# EasyEDA Pro project demo.eprj

# Schematic Schematic1
Board Name: Board1; Create Date: 2026-05-03; Page Name: P1; Project Name: demo; Schematic Name: Schematic1; Update Date: 2026-06-27; Company: 嘉立创EDA; Page Size: A4; Version: V1.0
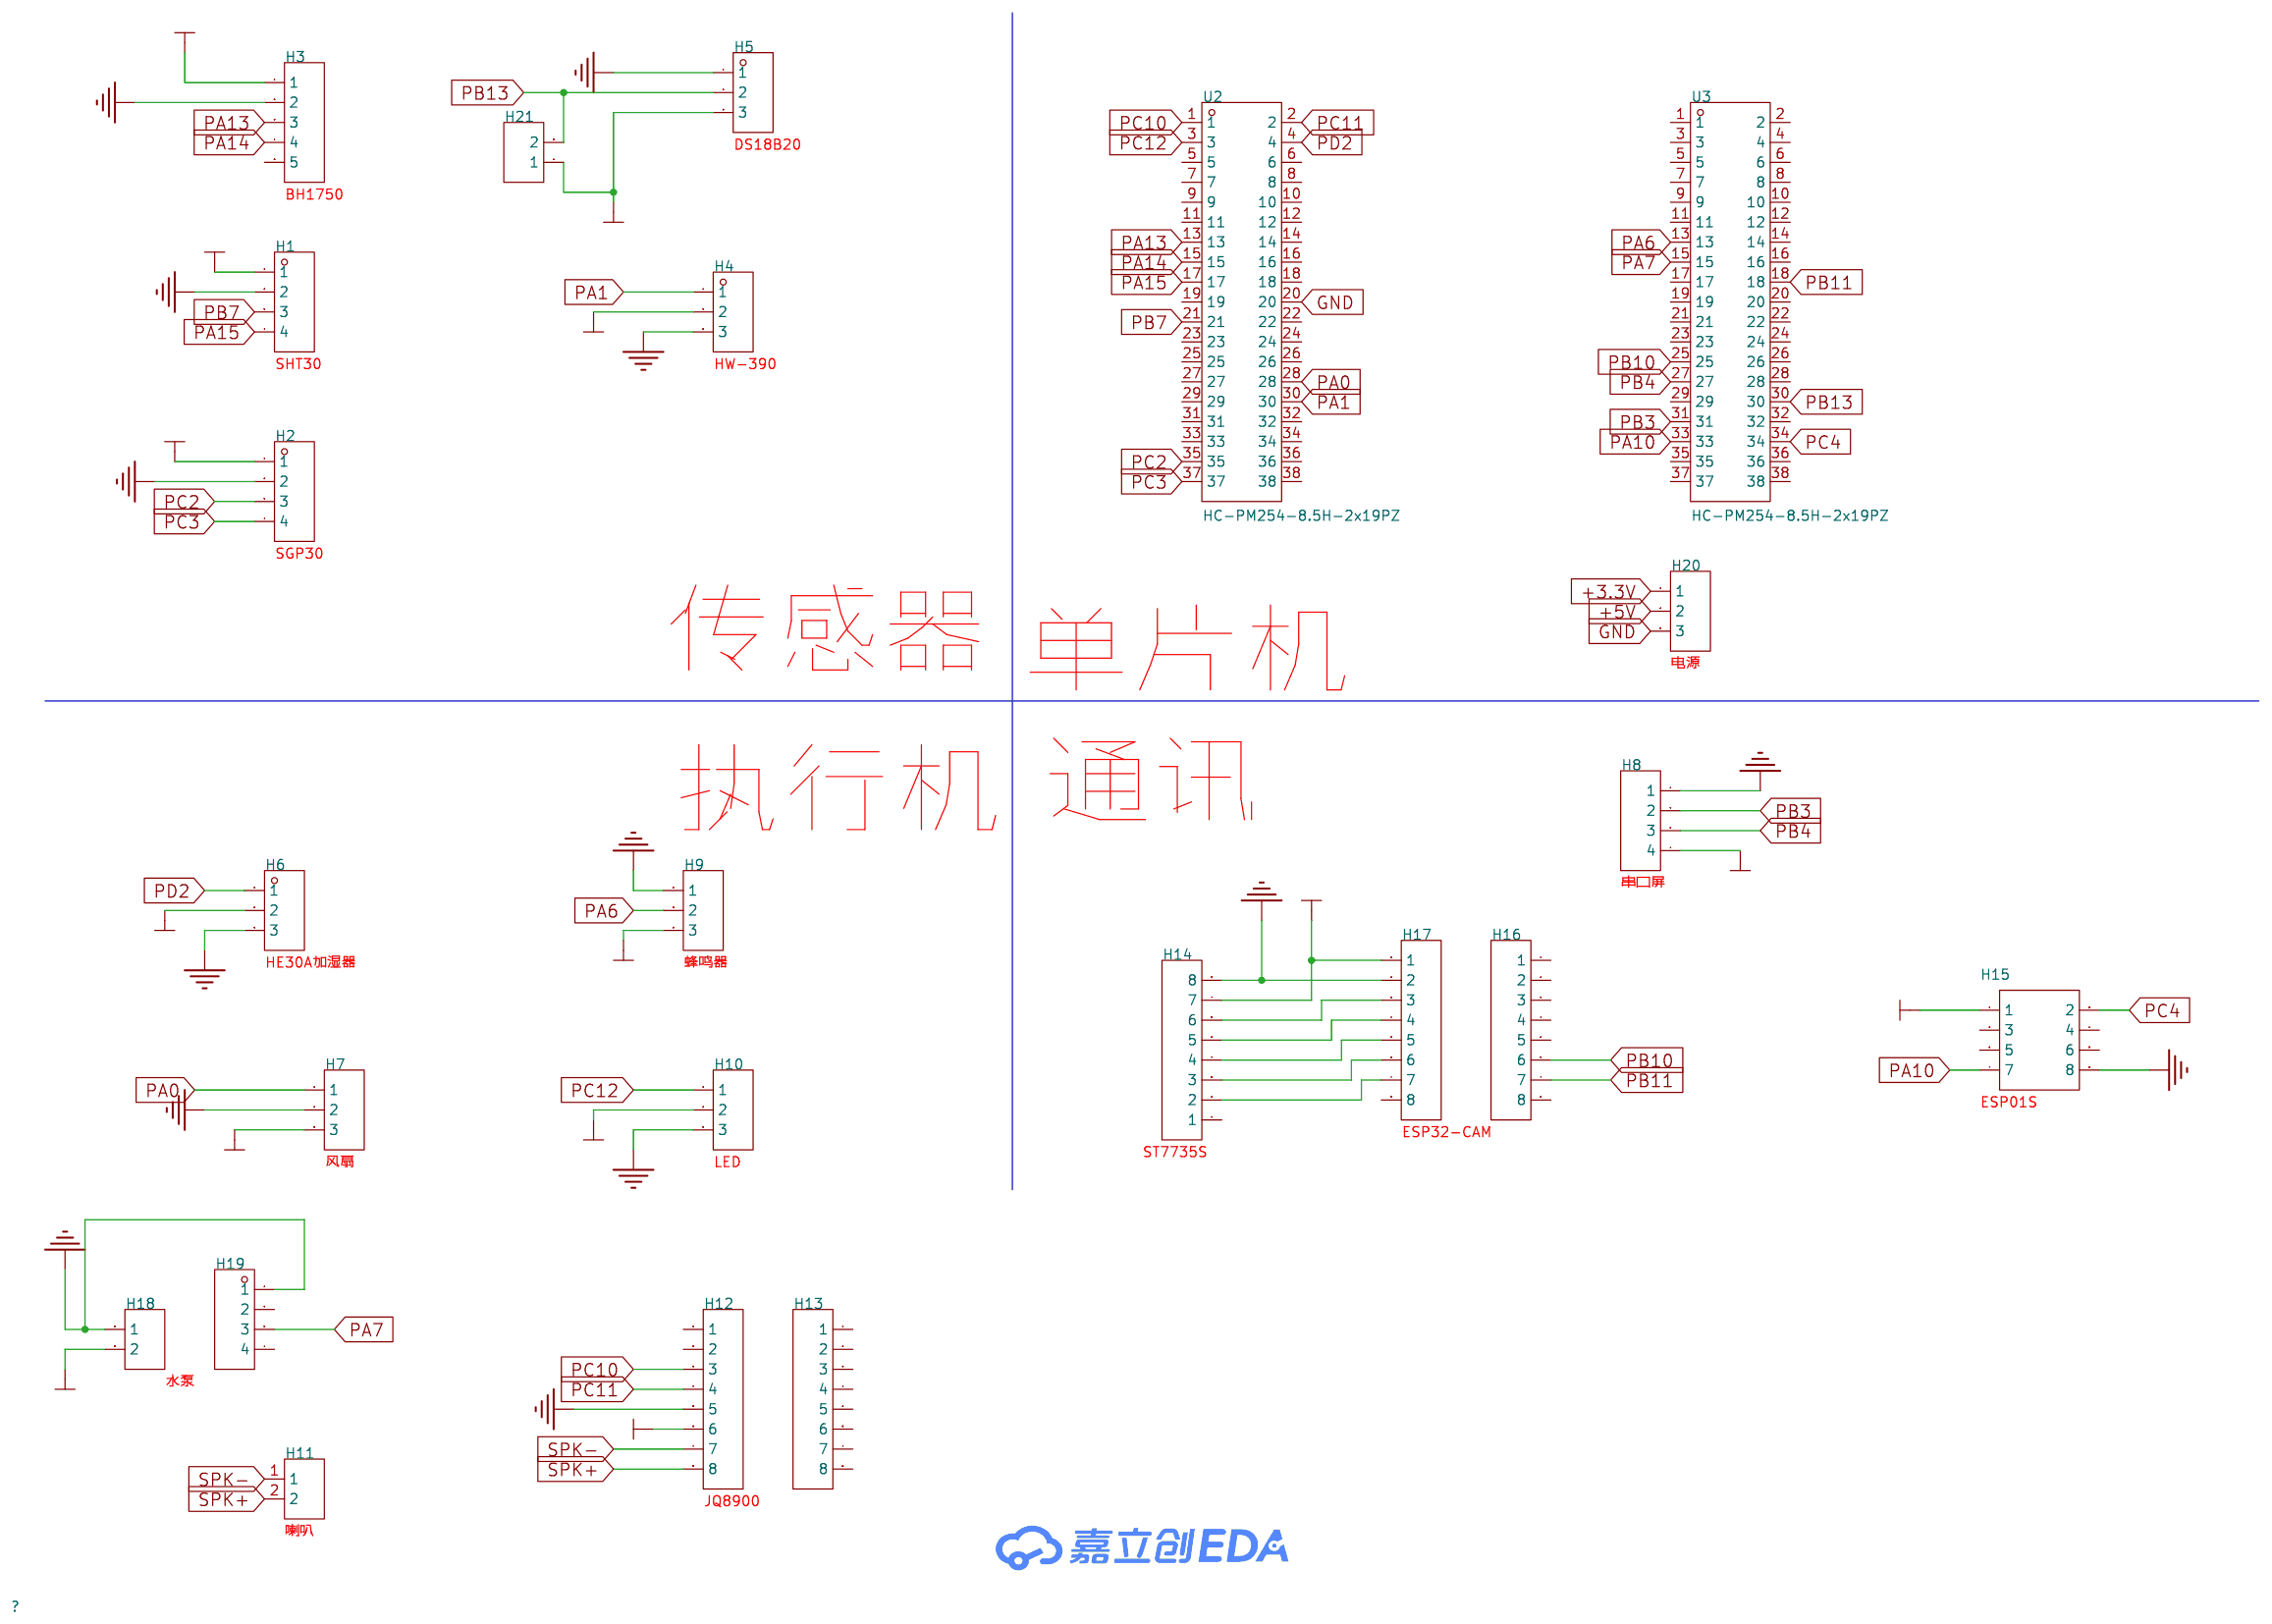
[diagram p0: schematic sheet]

## Parts
H1  -  [HDR-TH_4P-P2.54-V-F]
H2  -  [HDR-TH_4P-P2.54-V-F]
H3  -  [HDR-TH_5P-P2.54-V-F]
H4  -  [HDR-TH_3P-P2.54-V-M]
H5  -  [HDR-TH_3P-P2.54-V-M]
H6  -  [HDR-TH_3P-P2.54-V-M]
H7  -  [HDR-TH_3P-P2.54-V-F]
H8  -  [HDR-TH_4P-P2.54-V-M]
H9  -  [HDR-TH_3P-P2.54-V-F]
H10  -  [HDR-TH_3P-P2.54-V-F]
H11  -  [HDR-TH_2P-P2.54-V-M-1]
H12  -  [HDR-TH_8P-P2.54-V-F-1]
H13  -  [HDR-TH_8P-P2.54-V-F-1]
H14  -  [HDR-TH_8P-P2.54-V-F-1]
H15  -  [HDR-TH_8P-P2.54-V-F-R2-C4-S2.54-1]
H16  -  [HDR-TH_8P-P2.54-V-F-1]
H17  -  [HDR-TH_8P-P2.54-V-F-1]
H18  -  [HDR-TH_2P-P2.54-V-F]
H19  -  [HDR-TH_4P-P2.54-V-F]
H20  -  [HDR-TH_3P-P2.54-V-F]
H21  -  [HDR-TH_2P-P2.54-V-F]
U2  HC-PM254-8.5H-2x19PZ  [HDR-TH_38P-P2.54-V-F-R2-C19-S2.54]
U3  HC-PM254-8.5H-2x19PZ  [HDR-TH_38P-P2.54-V-F-R2-C19-S2.54]

## Library data of the parts
H1 H2 H19 = HDR-F_2.54_1x4P: Supplier Part: C2718488; Supplier Footprint: 插件
H3 = HDR-F_2.54_1x5P: Supplier Part: C50950; Supplier Footprint: 插件
H4-H6 = HDR-M_2.54_1x3P: Supplier Part: C2937625; Supplier Footprint: 插件
H7 H9 H10 H20 = HDR-F_2.54_1x3P: Supplier Part: C541850; Supplier Footprint: 插件
H8 = HDR-M_2.54_1x4P: Supplier Part: C492403; Supplier Footprint: 插件
H11 = HDR-M_2.54_1x2P: Supplier Part: C124375; Supplier Footprint: 插件
H12-H14 H16 H17 = HDR-F_2.54_1x8P: Supplier Part: C27438; Supplier Footprint: 插件
H15 = HDR-F_2.54_2x4: Supplier Part: C92271; Supplier Footprint: 插件
H18 H21 = HDR-F_2.54_1x2P: Supplier Part: C49661; Supplier Footprint: 插件
U2 U3 = HC-PM254-8.5H-2x19PZ: LCSC Part Name: 间距2.54mm 2x19Pin 直插 PC3.0 H8.5; Supplier Part: C22373924; Manufacturer: HC(虹成电子); Supplier Footprint: 插件,P=2.54mm; JLCPCB Part Class: 扩展库; Datasheet: https://item.szlcsc.com/datasheet/HC-PM254-8.5H-2x19PZ/23870260.html; Supplier: LCSC; Holes Structure: 2x19P; Pitch: 2.54mm; Row Spacing: 2.54mm; Circular Hole / Square Hole: 方孔; Mounting Type: 直插; Number of Rows: 双排; Number of Positions: 38P; Current Rating: 3A; Holes Direction: 顶部; Insulation Height: 8.5mm; Contact Material: 黄铜; Contact Plating: 金; Operating Temperature: -40℃~+105℃; PIN Length: 3mm

## Nets
+3.3V: H1.1 H2.1 H3.1 H4.2 H6.2 H7.3 H9.3 H15.1 H20.1
+5V: H5.3 H8.4 H10.2 H12.6 H14.7 H17.1 H18.2 H20.2 H21.1
GND: H1.2 H2.2 H3.2 H4.3 H5.1 H6.3 H7.2 H8.1 H9.1 H10.3 H12.5 H14.8 H15.8 H17.2 H18.1 H19.1 H20.3 U2.20
PA0: H7.1 U2.28
PA1: H4.1 U2.30
PA6: H9.2 U3.13
PA7: H19.3 U3.15
PA10: H15.7 U3.33
PA13: H3.3 U2.13
PA14: H3.4 U2.15
PA15: H1.4 U2.17
PB3: H8.2 U3.31
PB4: H8.3 U3.27
PB7: H1.3 U2.21
PB10: H16.6 U3.25
PB11: H16.7 U3.18
PB13: H5.2 H21.2 U3.30
PC2: H2.3 U2.35
PC3: H2.4 U2.37
PC4: H15.2 U3.34
PC10: H12.3 U2.1
PC11: H12.4 U2.2
PC12: H10.1 U2.3
PD2: H6.1 U2.4
SPK+: H11.2 H12.8
SPK-: H11.1 H12.7
$1N6070: H14.6 H17.3
$1N6076: H14.5 H17.4
$1N6082: H14.4 H17.5
$1N6088: H14.3 H17.6
$1N6116: H14.2 H17.7

Not connected (* = marked no-connect by the designer): H3 5; H12 1 2; H13 1 2 3 4 5 6 7 8; H14 1; H15 3 4 5 6; H16 1 2 3 4 5 8; H17 8; H19 2 4; U2 5 6 7 8 9 10 11 12 14 16 18 19 22 23 24 25 26 27 29 31 32 33 34 36 38; U3 1 2 3 4 5 6 7 8 9 10 11 12 14 16 17 19 20 21 22 23 24 26 28 29 32 35 36 37 38

## Notes on the sheet
- DS18B20
- BH1750
- SHT30
- HW-390
- SGP30
- 传感器
- 电源
- 单片机
- 执行机
- 通讯
- 串口屏
- HE30A加湿器
- 蜂鸣器
- ESP01S
- ESP32-CAM
- 风扇
- LED
- ST7735S
- 水泵
- JQ8900
- 喇叭

# Board PCB1
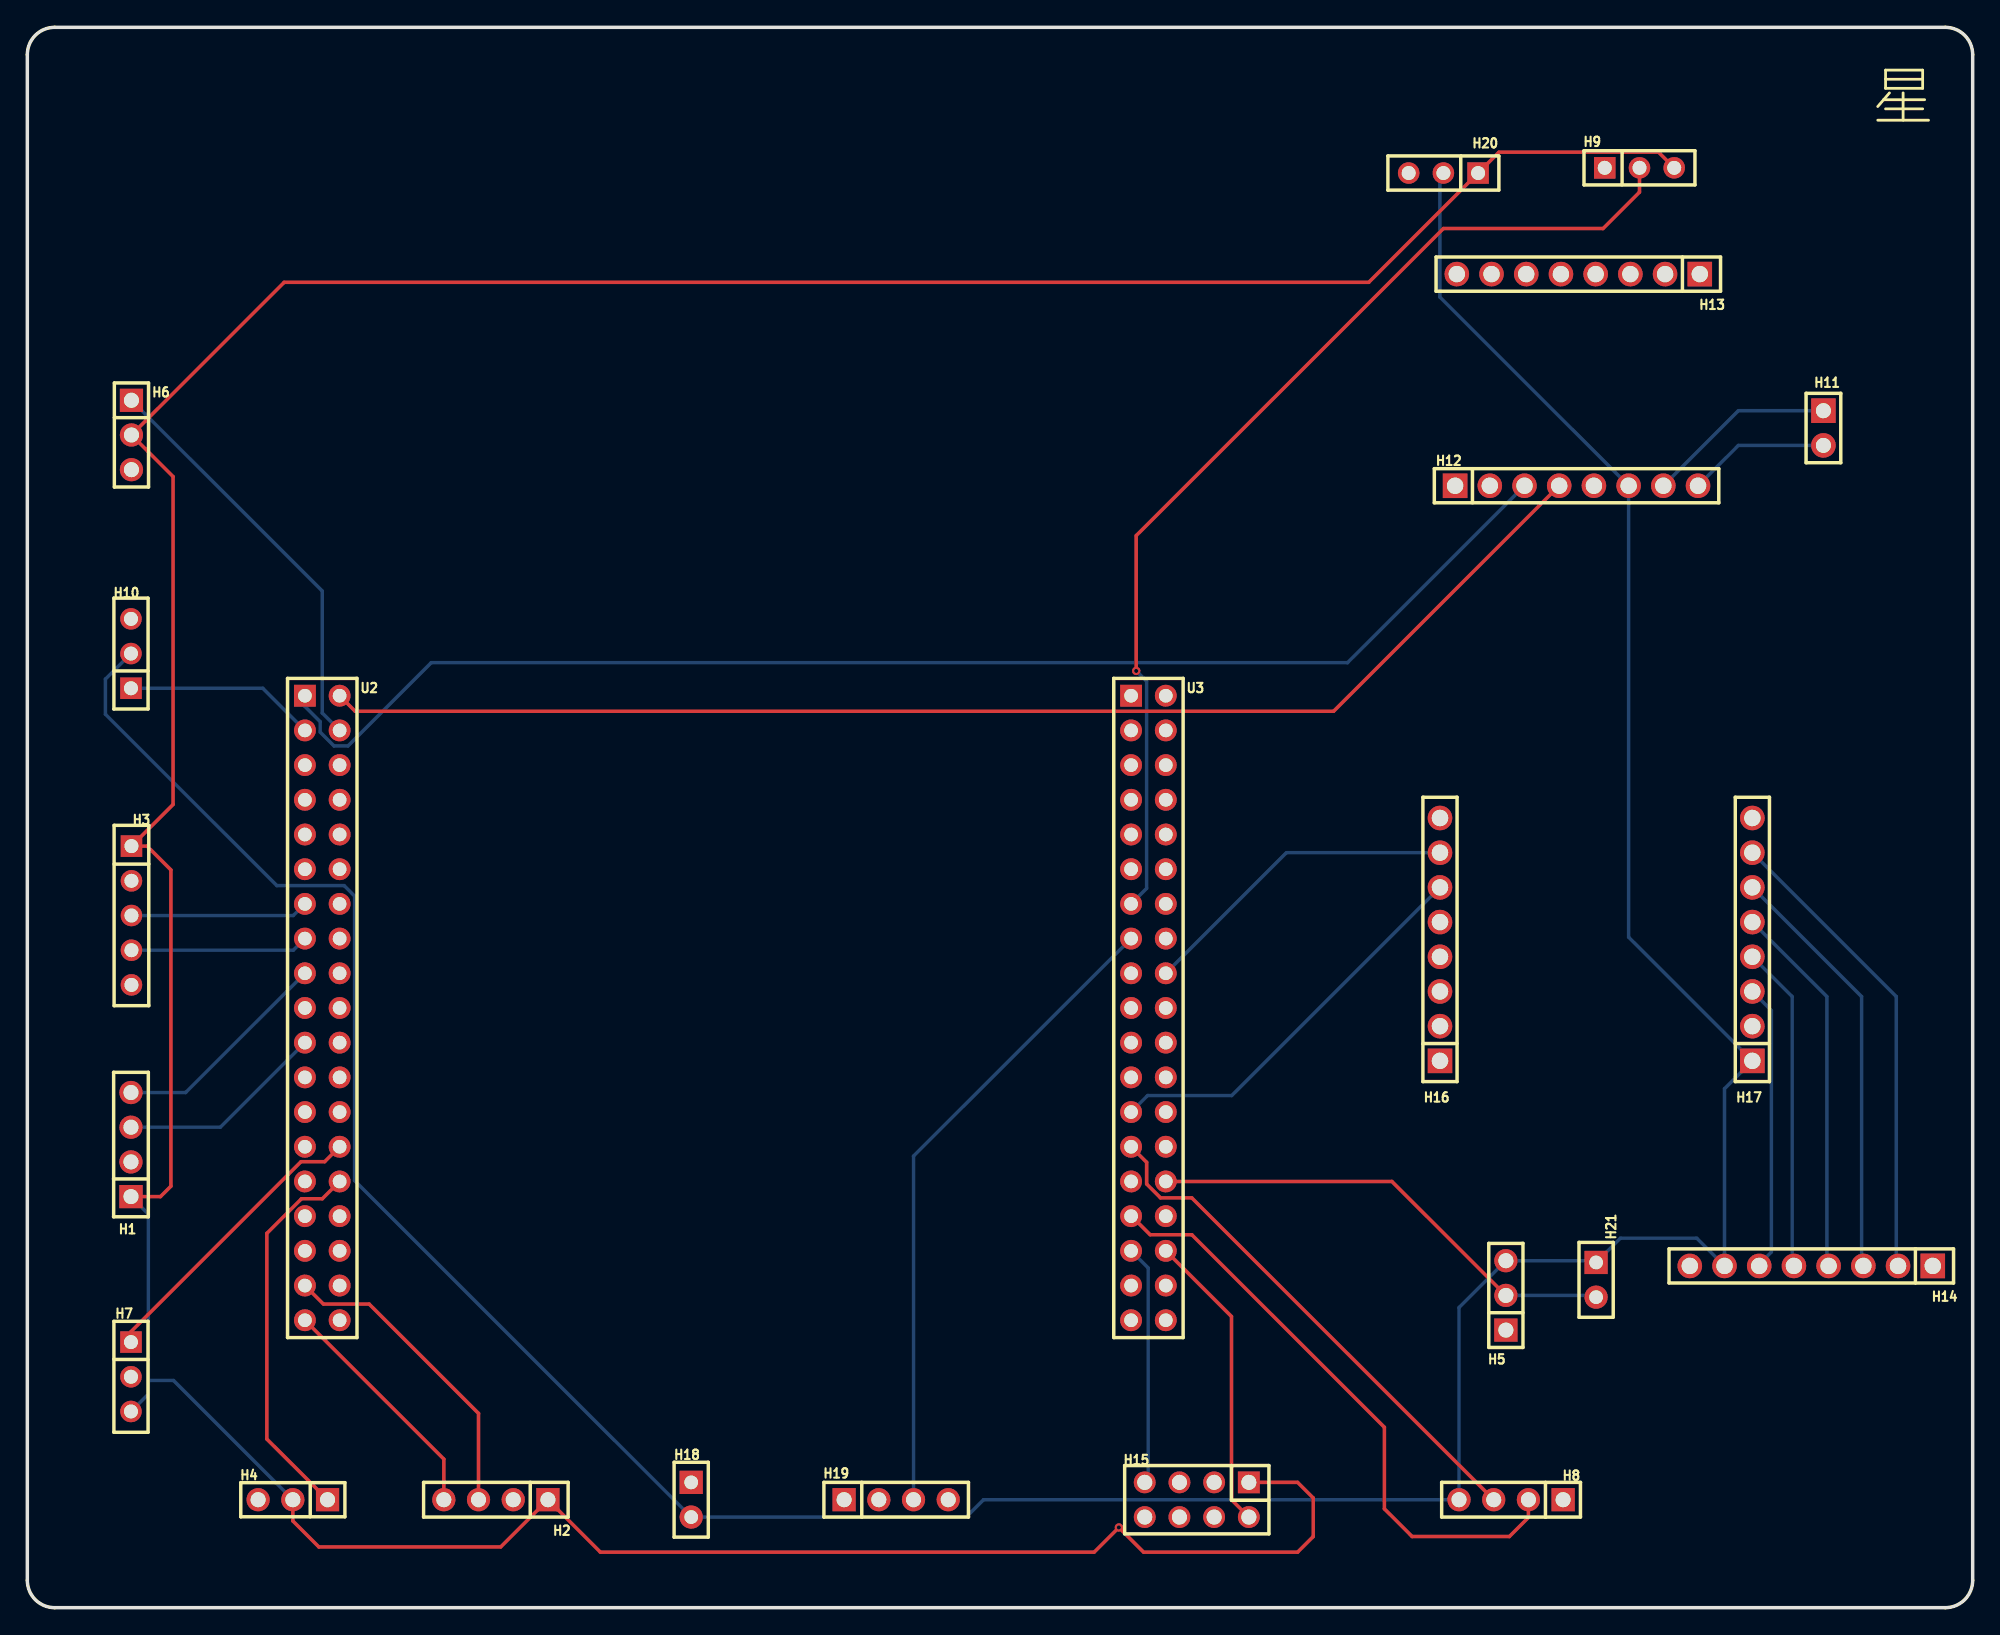
[diagram p1: board, top side]
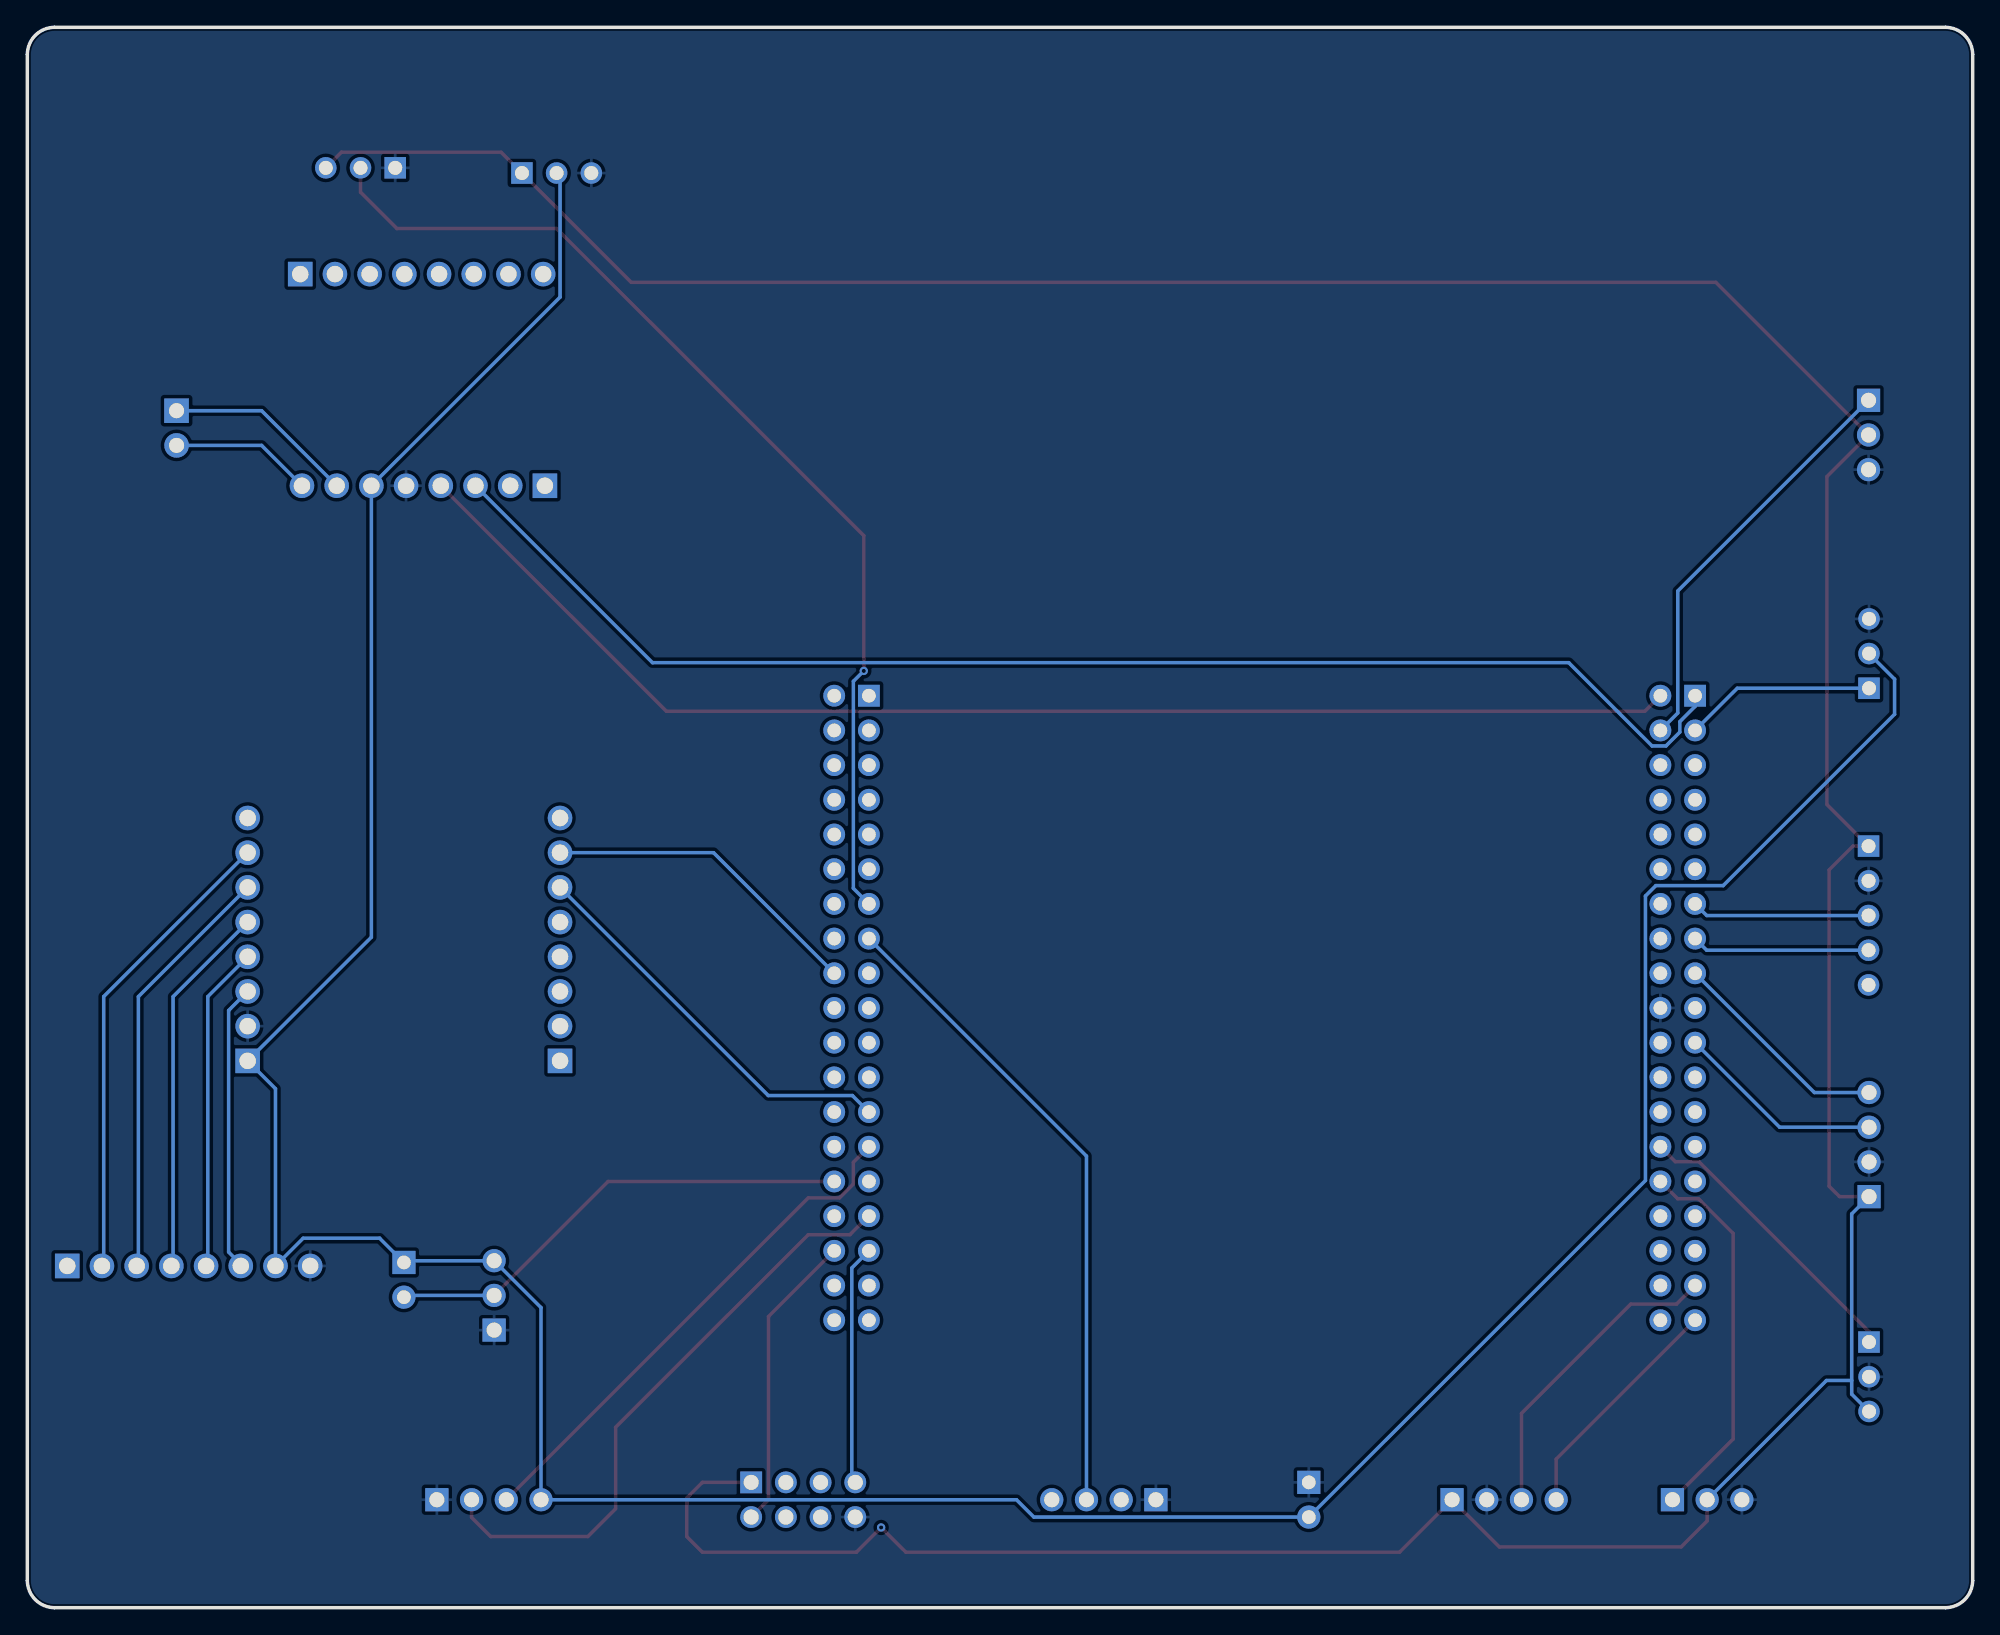
[diagram p2: board, bottom side, seen from below]

Outline 142.37 x 115.7 mm; copper layers: Top Layer, Bottom Layer. Coordinates in mm from the lower left corner of the outline.
Outline path: 0,113.7 0,2 arc(0.59,0.59) 2,0 140.37,0 arc(141.78,0.59) 142.37,2 142.37,113.7 arc(141.78,115.11) 140.37,115.7 2,115.7 arc(0.59,115.11) 0,113.7
Stack: Top Layer 0.035mm / Dielectric1 1.51mm FR4 er 4.5 / Bottom Layer 0.035mm

## Design rules (mm)
template: JLCPCB Capability(Two Layers Board)
spacing copperThickness1oz (default): track to track 0.102, other pairs 0.152 to 0.3
spacing copperThickness2oz: track to track 0.203, other pairs 0.152 to 0.3
track width copperThickness1oz (default): min 0.127, default 0.254, max 2.54
track width copperThickness2oz: min 0.203, default 0.254, max 2.54
differential pair differentialPair (default): width min 0.127, default 0.254, max 2.54; gap min 0.152, default 0.152
via viaSize (default): diameter min 0.5, default 0.61, max 10; hole min 0.3, default 0.305, max 6.3

## Placement (name value [footprint] x y rotation side)
H1  -  [HDR-TH_4P-P2.54-V-F]  7.58 33.9 90 top
H2  -  [HDR-TH_4P-P2.54-V-F]  34.29 7.9 180 top
H3  -  [HDR-TH_5P-P2.54-V-F]  7.62 50.67 270 top
H4  -  [HDR-TH_3P-P2.54-V-M]  19.43 7.9 180 top
H5  -  [HDR-TH_3P-P2.54-V-M]  108.21 22.86 90 top
H6  -  [HDR-TH_3P-P2.54-V-M]  7.62 85.85 270 top
H7  -  [HDR-TH_3P-P2.54-V-F]  7.58 16.9 270 top
H8  -  [HDR-TH_4P-P2.54-V-M]  108.58 7.9 180 top
H9  -  [HDR-TH_3P-P2.54-V-F]  117.98 105.41 0 top
H10  -  [HDR-TH_3P-P2.54-V-F]  7.58 69.85 90 top
H11  -  [HDR-TH_2P-P2.54-V-M-1]  131.44 86.36 270 top
H12  -  [HDR-TH_8P-P2.54-V-F-1]  113.38 82.14 0 top
H13  -  [HDR-TH_8P-P2.54-V-F-1]  113.51 97.63 180 top
H14  -  [HDR-TH_8P-P2.54-V-F-1]  130.56 25.02 180 top
H15  -  [HDR-TH_8P-P2.54-V-F-R2-C4-S2.54-1]  85.58 7.9 180 top
H16  -  [HDR-TH_8P-P2.54-V-F-1]  103.38 48.92 90 top
H17  -  [HDR-TH_8P-P2.54-V-F-1]  126.24 48.92 90 top
H18  -  [HDR-TH_2P-P2.54-V-F]  48.58 7.9 270 top
H19  -  [HDR-TH_4P-P2.54-V-F]  63.58 7.9 0 top
H20  -  [HDR-TH_3P-P2.54-V-F]  103.63 105.03 180 top
H21  -  [HDR-TH_2P-P2.54-V-F]  114.81 24 270 top
U2  HC-PM254-8.5H-2x19PZ  [HDR-TH_38P-P2.54-V-F-R2-C19-S2.54]  21.58 43.9 270 top
U3  HC-PM254-8.5H-2x19PZ  [HDR-TH_38P-P2.54-V-F-R2-C19-S2.54]  82.05 43.9 270 top

## Footprints (pads in the part's own frame, mm; a bottom-side part is the same pattern mirrored in y, then rotated)
HDR-TH_2P-P2.54-V-F
  rect 1.7x1.7 hole 1: 1(-1.27,0)
  round 1.7 hole 1: 2(1.27,0)
HDR-TH_2P-P2.54-V-M-1
  rect 1.8x1.8 hole 1.1: 1(-1.27,0)
  round 1.8 hole 1.1: 2(1.27,0)
HDR-TH_3P-P2.54-V-F
  rect 1.575x1.575 hole 1.02: 1(-2.54,0)
  round 1.575 hole 1.02: 2(0,0) 3(2.54,0)
HDR-TH_3P-P2.54-V-M
  rect 1.7x1.7 hole 1.1: 1(-2.54,0)
  round 1.7 hole 1.1: 2(0,0) 3(2.54,0)
HDR-TH_4P-P2.54-V-F
  rect 1.7x1.7 hole 1.1: 1(-3.81,0)
  round 1.7 hole 1.1: 2(-1.27,0) 3(1.27,0) 4(3.81,0)
HDR-TH_4P-P2.54-V-M
  rect 1.7x1.7 hole 1.1: 1(-3.81,0)
  round 1.7 hole 1.1: 2(-1.27,0) 3(1.27,0) 4(3.81,0)
HDR-TH_5P-P2.54-V-F
  rect 1.575x1.575 hole 1.02: 1(-5.08,0)
  round 1.575 hole 1.02: 2(-2.54,0) 3(0,0) 4(2.54,0) 5(5.08,0)
HDR-TH_8P-P2.54-V-F-1
  rect 1.8x1.8 hole 1.2: 1(-8.89,0)
  round 1.8 hole 1.2: 2(-6.35,0) 3(-3.81,0) 4(-1.27,0) 5(1.27,0) 6(3.81,0) 7(6.35,0) 8(8.89,0)
HDR-TH_8P-P2.54-V-F-R2-C4-S2.54-1
  rect 1.6x1.6 hole 1.1: 1(-3.81,-1.27)
  round 1.6 hole 1.1: 2(-3.81,1.27) 3(-1.27,-1.27) 4(-1.27,1.27) 5(1.27,-1.27) 6(1.27,1.27) 7(3.81,-1.27) 8(3.81,1.27)
HDR-TH_38P-P2.54-V-F-R2-C19-S2.54
  rect 1.6x1.6 hole 1: 1(-22.86,-1.27)
  round 1.6 hole 1: 2(-22.86,1.27) 3(-20.32,-1.27) 4(-20.32,1.27) 5(-17.78,-1.27) 6(-17.78,1.27) 7(-15.24,-1.27) 8(-15.24,1.27) 9(-12.7,-1.27) 10(-12.7,1.27) 11(-10.16,-1.27) 12(-10.16,1.27) 13(-7.62,-1.27) 14(-7.62,1.27) 15(-5.08,-1.27) 16(-5.08,1.27) 17(-2.54,-1.27) 18(-2.54,1.27) 19(0,-1.27) 20(0,1.27) 21(2.54,-1.27) 22(2.54,1.27) 23(5.08,-1.27) 24(5.08,1.27) 25(7.62,-1.27) 26(7.62,1.27) 27(10.16,-1.27) 28(10.16,1.27) 29(12.7,-1.27) 30(12.7,1.27) 31(15.24,-1.27) 32(15.24,1.27) 33(17.78,-1.27) 34(17.78,1.27) 35(20.32,-1.27) 36(20.32,1.27) 37(22.86,-1.27) 38(22.86,1.27)

## Nets
As in the schematic.

Pads without a net: H3 5; H12 1 2; H13 1 2 3 4 5 6 7 8; H14 1; H15 3 4 5 6; H16 1 2 3 4 5 8; H17 8; H19 2 4; U2 5 6 7 8 9 10 11 12 14 16 18 19 22 23 24 25 26 27 29 31 32 33 34 36 38; U3 1 2 3 4 5 6 7 8 9 10 11 12 14 16 17 19 20 21 22 23 24 26 28 29 32 35 36 37 38

## Via types
v1: diameter 0.61, hole 0.305, Top Layer to Bottom Layer, 2 vias

## Routing (per net, layer and track width the routed paths; a pad name or vN(x,y) marks a point on that pad's centre or on a via; arc(x,y) is an arc through that point)
+3.3V: length 305.6
  Top Layer w0.254: H1.1 9.74,30.09 10.51,30.86 10.51,54.01 8.76,55.75 H3.1 10.67,58.8 10.67,82.8 H6.2 18.8,97.03 98.17,97.03 H20.1 107.7,106.55 119.38,106.55 H9.3 ; H15.1 92.96,9.17 94.11,8.03 94.11,5.21 92.96,4.06 81.69,4.06 v1(79.88,5.87) 78.08,4.06 41.94,4.06 H2.1 34.64,4.44 21.34,4.44 19.43,6.35 H4.2
  Bottom Layer w0.254: 8.85,16.63 10.7,16.63 H4.2 ; 8.85,16.63 8.85,15.63 H7.3 ; 8.85,16.63 8.85,28.82 H1.1
+5V: length 268.3
  Bottom Layer w0.254: H10.2 5.71,67.98 5.71,65.41 18.26,52.86 23.18,52.86 23.95,52.1 23.95,31.27 H18.2 68.71,6.63 69.98,7.9 H8.4 104.77,21.97 H5.3 114.68,25.4 H21.1 116.59,27.05 122.17,27.05 H14.7 124.21,37.99 H17.1 117.19,49.09 H12.6 103.38,95.95 103.38,104.78 H20.2
PA0: length 21.6
  Top Layer w0.254: H7.1 7.58,20.21 20.03,32.65 21.76,32.65 U2.28
PA1: length 28.2
  Top Layer w0.254: U2.30 21.59,29.94 20.07,29.94 17.53,27.4 17.53,12.35 H4.1
PA6: length 76.8
  Top Layer w0.254: H9.2 117.98,103.63 115.32,100.97 103.63,100.97 81.15,78.49 v1(81.15,68.58)
  Bottom Layer w0.254: v1(81.15,68.58) 81.92,67.82 81.92,52.66 U3.13
PA7: length 47.7
  Bottom Layer w0.254: U3.15 64.86,33.06 H19.3
PA10: length 17.6
  Bottom Layer w0.254: H15.7 82.03,9.43 82.03,24.87 U3.33
PA13: length 13
  Bottom Layer w0.254: H3.3 19.46,50.67 U2.13
PA14: length 13
  Bottom Layer w0.254: H3.4 19.46,48.13 U2.15
PA15: length 16.3
  Bottom Layer w0.254: U2.17 11.58,37.71 H1.4
PB3: length 44.2
  Top Layer w0.254: H8.2 109.86,6.6 108.46,5.21 101.35,5.21 99.31,7.24 99.31,13.21 85.22,27.31 82.17,27.31 80.81,28.66 U3.31
PB4: length 38.2
  Top Layer w0.254: U3.27 81.92,32.61 81.92,31.02 82.93,30 85.22,30 H8.3
PB7: length 15.3
  Bottom Layer w0.254: H1.3 14.12,35.17 U2.21
PB10: length 29.4
  Bottom Layer w0.254: H16.6 88.14,37.49 81.98,37.49 U3.25
PB11: length 23.7
  Bottom Layer w0.254: H16.7 92.14,55.27 U3.18
PB13: length 35
  Top Layer w0.254: H5.2 99.86,31.2 U3.30
  Bottom Layer w0.254: H21.2 114.68,22.86 H5.2
PC2: length 22.9
  Top Layer w0.254: U2.35 21.67,22.22 25.02,22.22 33.02,14.22 H2.3
PC3: length 17.4
  Top Layer w0.254: H2.4 30.48,10.88 U2.37
PC4: length 22
  Top Layer w0.254: U3.34 88.12,21.32 88.12,7.9 H15.2
PC10: length 99.6
  Bottom Layer w0.254: H12.3 96.61,69.18 29.56,69.18 23.46,63.09 22.45,63.09 21.43,64.1 21.43,64.86 20.31,65.98 U2.1
PC11: length 96.6
  Top Layer w0.254: U2.2 23.99,65.63 95.6,65.63 H12.4
PC12: length 14
  Bottom Layer w0.254: U2.3 17.23,67.31 H10.1
PD2: length 30.5
  Bottom Layer w0.254: H6.1 21.58,74.43 21.58,65.49 U2.4
SPK+: length 10.4
  Bottom Layer w0.254: H11.2 125.22,85.09 H12.8
SPK-: length 14
  Bottom Layer w0.254: H12.7 125.22,87.63 H11.1
$1N6070: length 21.1
  Bottom Layer w0.254: 126.62,25.02 127.64,26.03 127.64,43.72 H17.3
$1N6076: length 23.8
  Bottom Layer w0.254: H17.4 129.16,44.74 129.16,25.02
$1N6082: length 27.4
  Bottom Layer w0.254: H17.5 131.7,44.74 131.7,25.02
$1N6088: length 31
  Bottom Layer w0.254: 134.24,25.02 134.24,44.74 H17.6
$1N6116: length 34.6
  Bottom Layer w0.254: 136.78,25.02 136.78,44.74 H17.7

## Copper pours and planes (outline as drawn; the poured copper is in the pictures)
GND on Bottom Layer: -13.59,124.59 154.43,124.59 154.43,-14.6 -13.59,-14.6

## Text on the board
Top Silkscreen Layer: 星
